# EAGLE design tap sens (EAGLE 9.6.2)
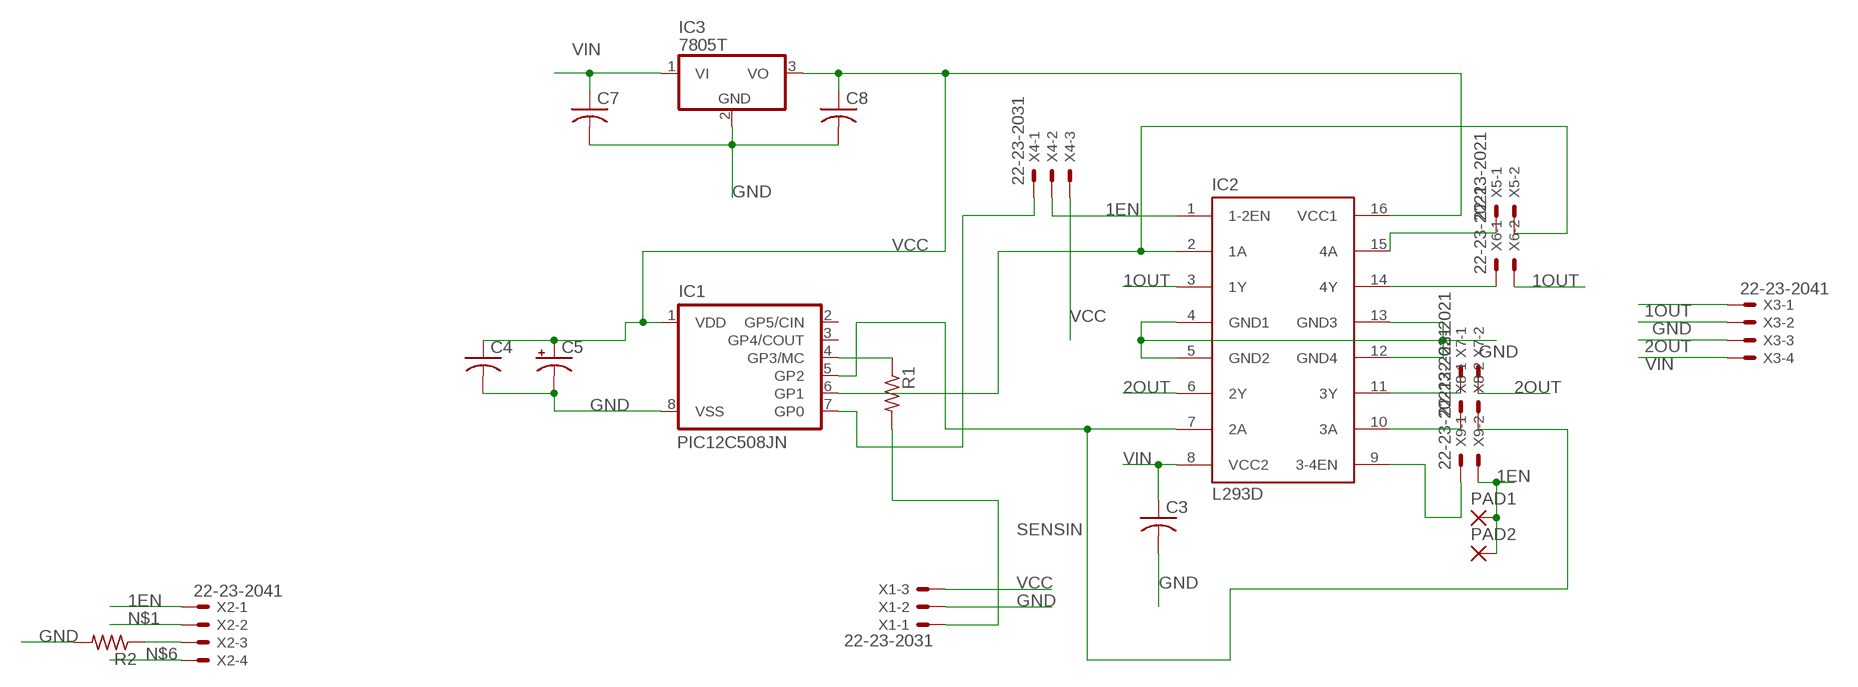
[diagram p0: schematic, sheet 1]

## Parts
C3  C-US050-025X075  [C050-025X075]
C4  C-US050-025X075  [C050-025X075]
C5  CPOL-USE5-8.5  [E5-8,5]
C7  C-US050-025X075  [C050-025X075]
C8  C-US050-025X075  [C050-025X075]
IC1  PIC12C508JN  [DIL8]
IC2  L293D  [DIL16]
IC3  7805T  [TO220H]
PAD1  2,54/0,8  [2,54/0,8]
PAD2  2,54/0,8  [2,54/0,8]
R1  R-US_0207/10  [0207/10]
R2  R-US_0207/10  [0207/10]
X1  22-23-2031  [22-23-2031]
X2  22-23-2041  [22-23-2041]
X3  22-23-2041  [22-23-2041]
X4  22-23-2031  [22-23-2031]
X5  22-23-2021  [22-23-2021]
X6  22-23-2021  [22-23-2021]
X7  22-23-2021  [22-23-2021]
X8  22-23-2021  [22-23-2021]
X9  22-23-2021  [22-23-2021]

## Nets
1EN: IC2.1(1-2EN) PAD1.1(P) PAD2.1(P) X2.1 X4.2 X9.2
1OUT: IC2.3(1Y) X3.1 X6.2
2OUT: IC2.6(2Y) X3.3 X7.2
GND: C3.2 C4.2 C5.- C7.2 C8.2 IC1.8(VSS) IC2.4(GND1) IC2.5(GND2) IC2.12(GND4) IC2.13(GND3) IC3.2(GND) R2.2 X1.2 X3.2
N$1: IC1.6(GP1) IC2.2(1A) X2.2 X5.2
N$2: R2.1 X2.3
N$3: IC1.4(GP3/MC) R1.1
N$6: IC1.5(GP2) IC2.7(2A) X2.4 X8.2
N$9: IC1.7(GP0) X4.1
N$12: IC2.9(3-4EN) X9.1
N$13: IC2.10(3A) X8.1
N$14: IC2.11(3Y) X7.1
N$15: IC2.14(4Y) X6.1
N$16: IC2.15(4A) X5.1
SENSIN: R1.2 X1.1
VCC: C4.1 C5.+ C8.1 IC1.1(VDD) IC2.16(VCC1) IC3.3(VO) X1.3 X4.3
VIN: C3.1 C7.1 IC2.8(VCC2) IC3.1(VI) X3.4
Unconnected: IC1.2(GP5/CIN) IC1.3(GP4/COUT)

## Library data of the parts
C3 C4 C7 C8 = adafruit:C-US: CAPACITOR, American symbol
C5 = adafruit:CPOL-US: POLARIZED CAPACITOR, American symbol
IC1 = microchip:PIC12C*?: MICROCONTROLLER; MF: MICROCHIP; MPN: PIC12C508-04/P; OC_FARNELL: 9758771; OC_NEWARK: 60K6710
IC2 = st-microelectronics:L293D: PUSH-PULL 4 CHANNEL DRIVER; MPN: L293D; OC_FARNELL: 9589619; OC_NEWARK: 56P8249
IC3 = linear:78*: Positive VOLTAGE REGULATOR Source: http://cache.national.com/ds/LM/LM78L05.pdf http://www.fairchildsemi.com/ds/LM/LM7805.pdf
PAD1 PAD2 = wirepad:2,54/0,8: THROUGH-HOLE PAD
R1 R2 = adafruit:R-US_: RESISTOR, American symbol
X1 X4 = con-molex:22-23-2031: .100" (2.54mm) Center Header - 3 Pin; MF: MOLEX; MPN: 22-23-2031; OC_FARNELL: 1462950; OC_NEWARK: 30C0862
X2 X3 = con-molex:22-23-2041: .100" (2.54mm) Center Header - 4 Pin; MF: MOLEX; MPN: 22-23-2041; OC_FARNELL: 1462920; OC_NEWARK: 38C0355
X5-X9 = con-molex:22-23-2021: .100" (2.54mm) Center Header - 2 Pin; MF: MOLEX; MPN: 22-23-2021; OC_FARNELL: 1462926; OC_NEWARK: 25C3832

## Board
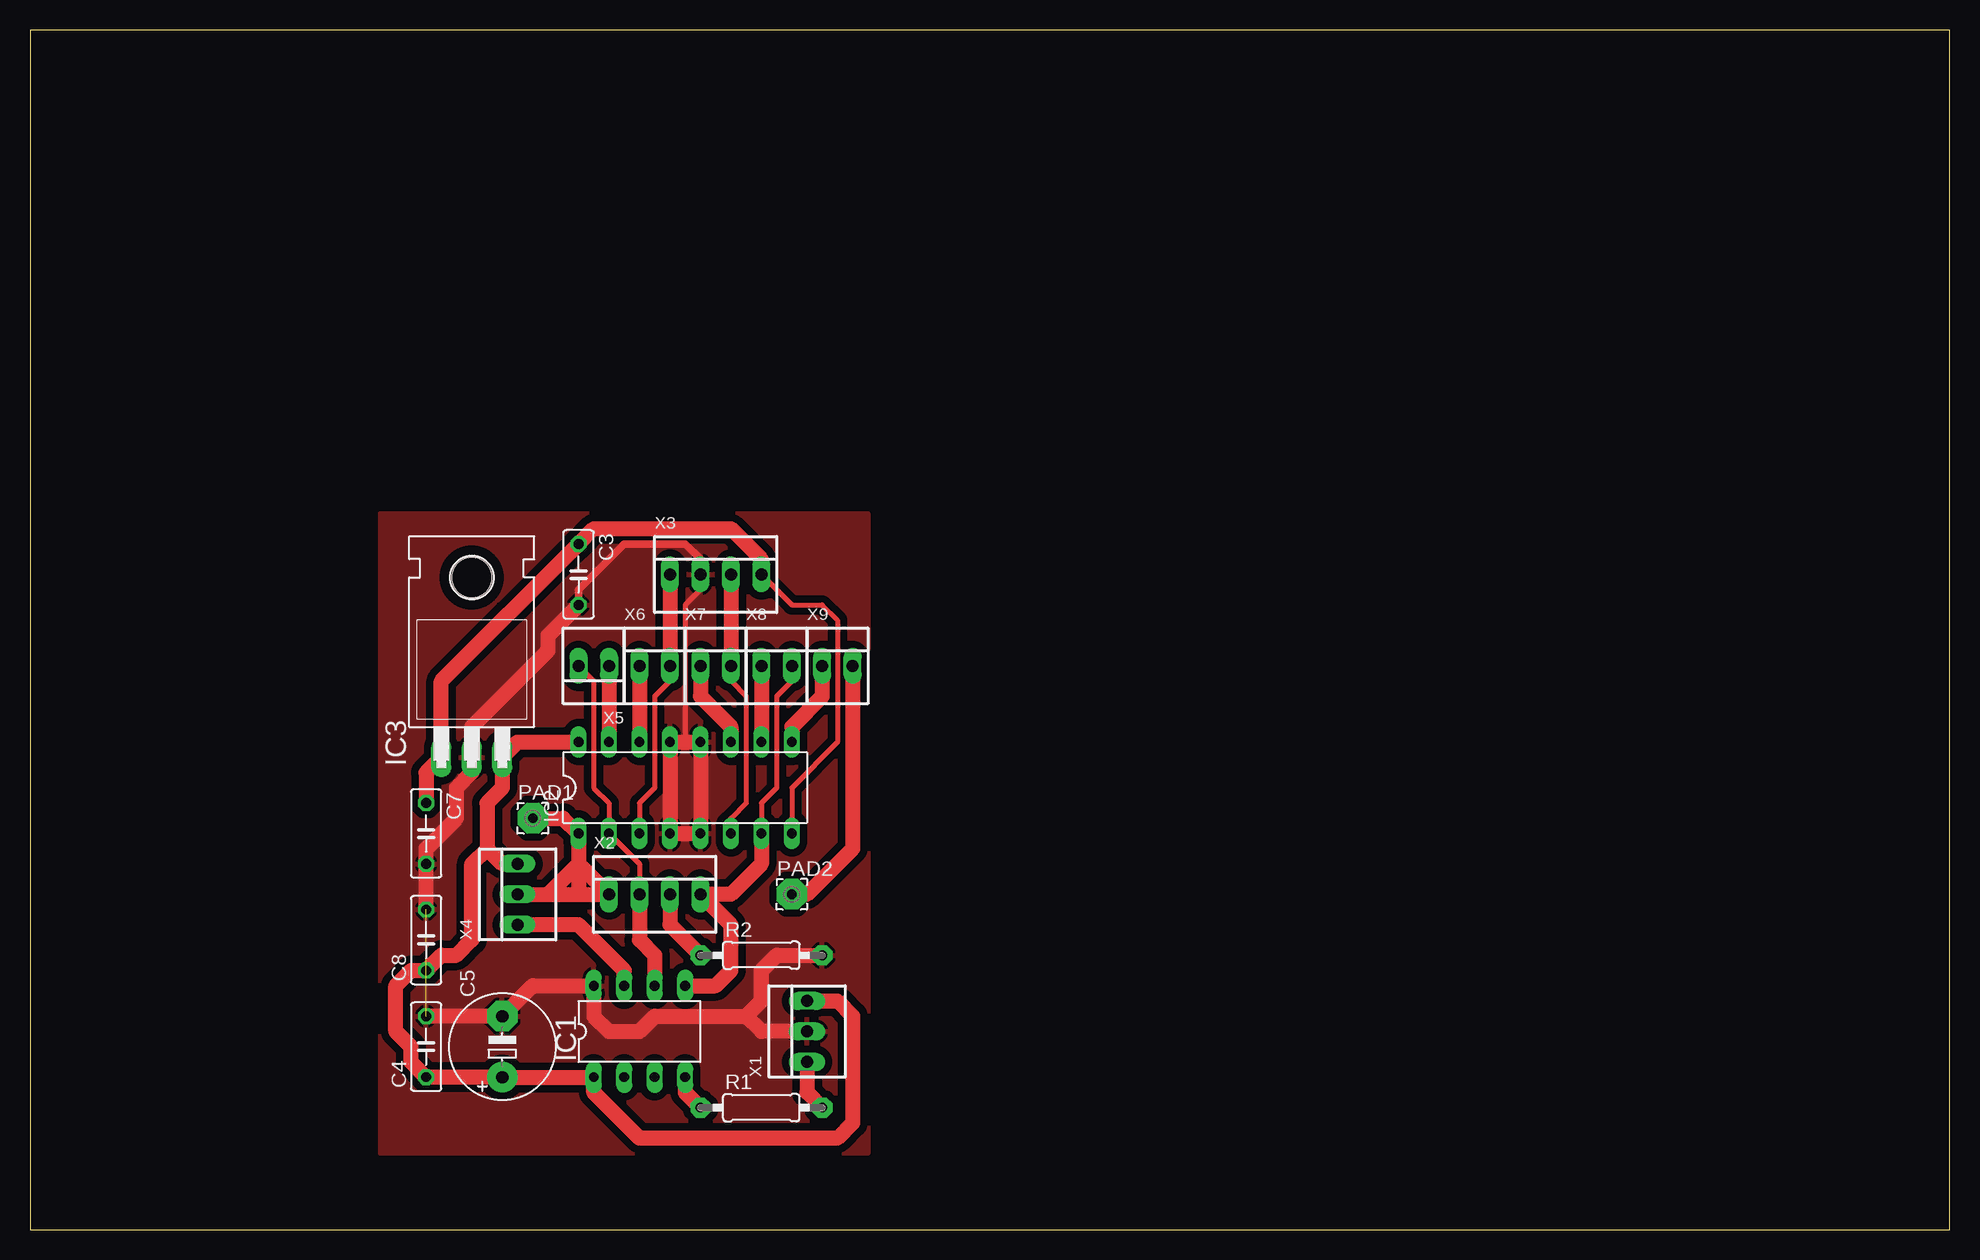
[diagram p1: board, top side]
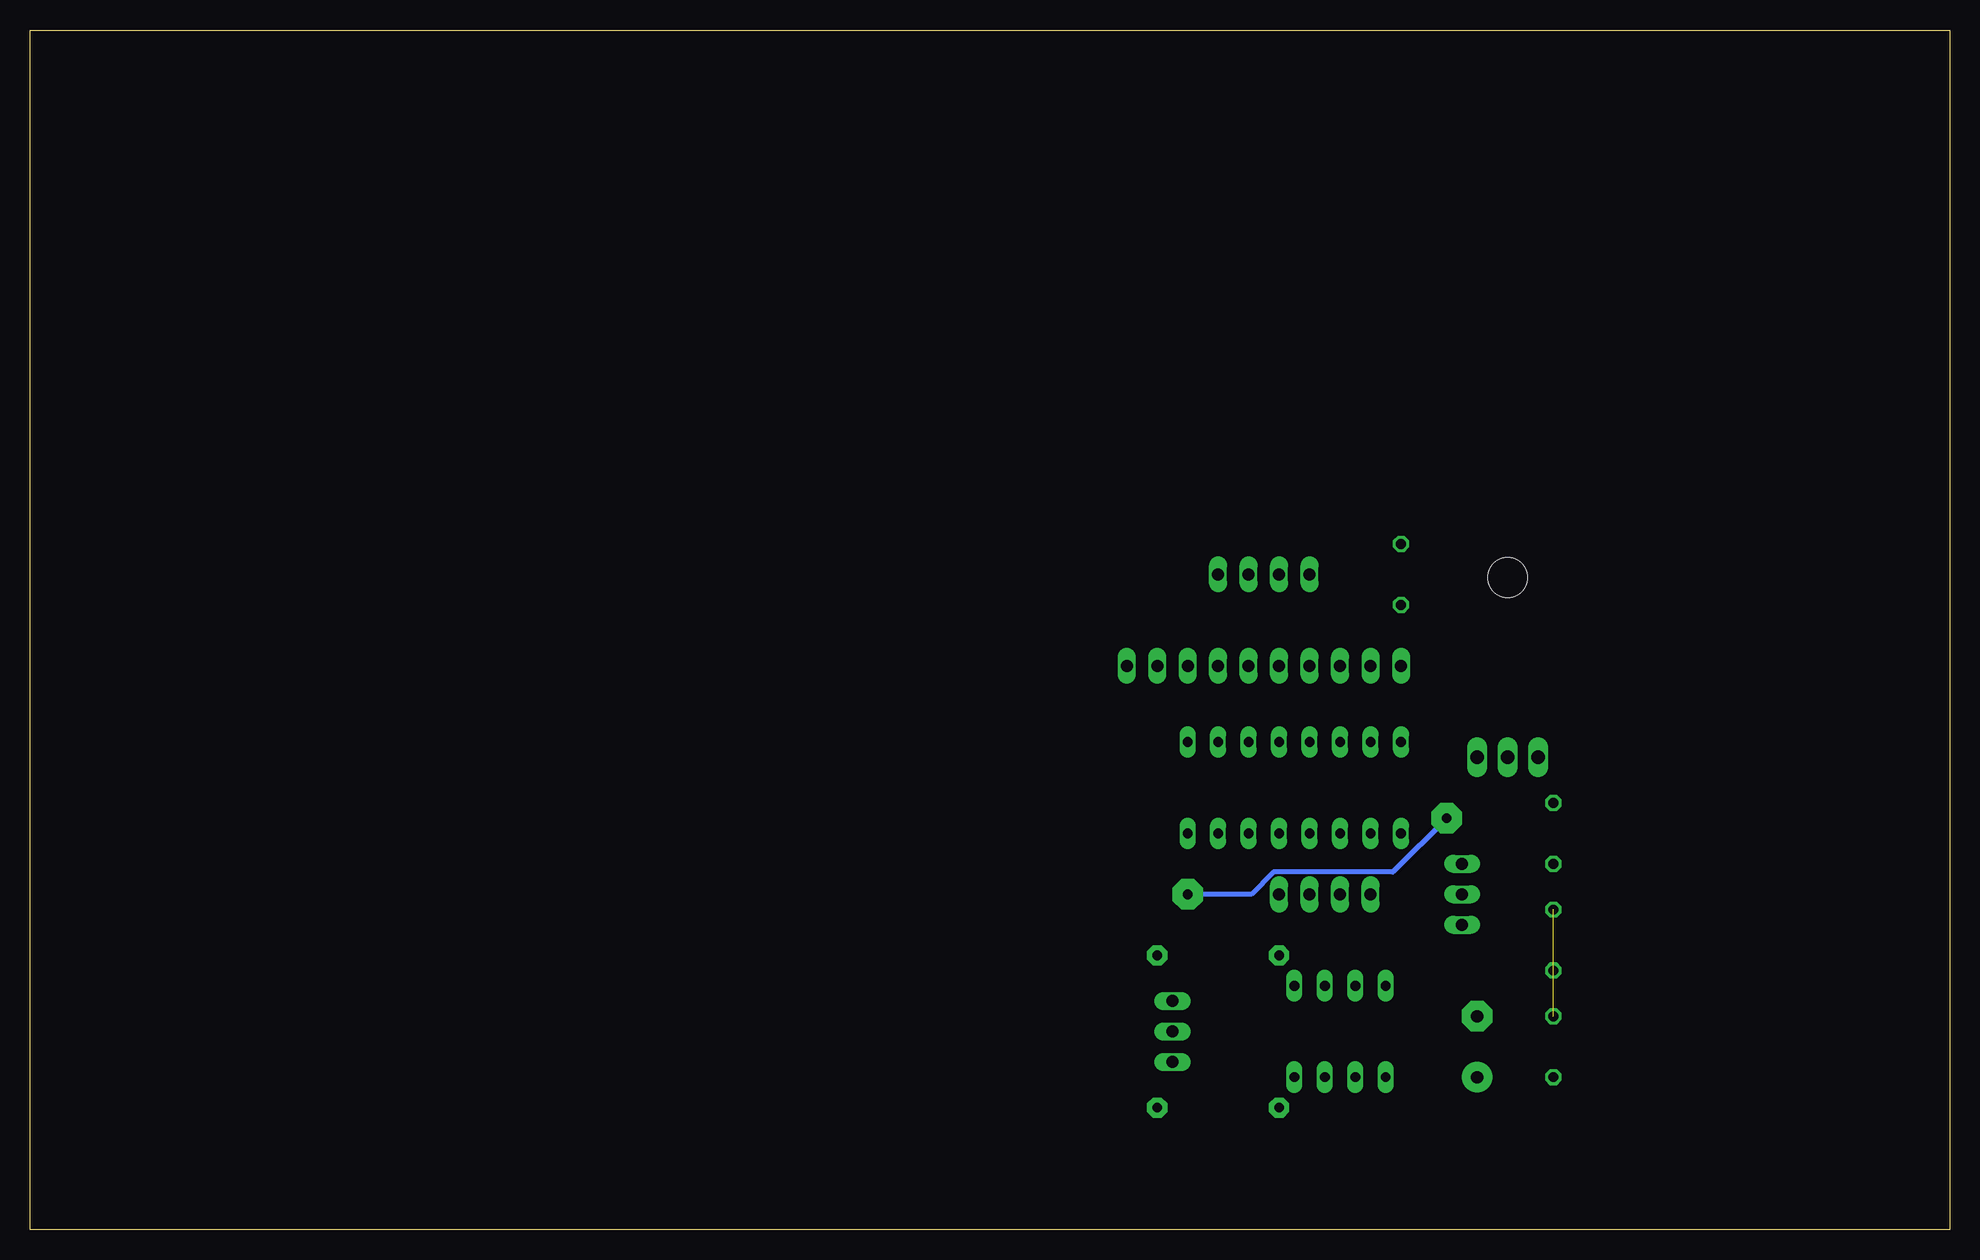
[diagram p2: board, bottom side, seen from below]

Size 160 x 100 mm. Coordinates in mm from the lower left corner, seen from the top.
Outline: 0,0 160,0 160,100 0,100 0,0
Copper layers (1*16): Top 0.035mm / dielectric 1.5mm / Bottom 0.035mm
Design rules "default": minimum track width 6mil, minimum drill 0.35mm, track to track 6mil, track to pad 6mil, pad to pad 6mil, via to via 6mil, smd to smd 6mil, copper to edge 40mil, drill to drill 6mil, minimum pad ring 10mil, minimum via ring 8mil, stop-mask expansion 4mil, vias tented up to drill 0mil, thermal gap 10mil

### Footprints (pad centres in the part's own frame; a part is rotated, then mirrored left to right if it is on the bottom)
C050-025X075 = drill 0.813 octagon: 1 -2.54,0; 2 2.54,0
E5-8,5 = drill 1.016 pad 2.54: + -2.54,0 | drill 1.016 pad 2.54 octagon: - 2.54,0
DIL8 = drill 0.813 long: 1 -3.81,-3.81; 2 -1.27,-3.81; 3 1.27,-3.81; 4 3.81,-3.81; 5 3.81,3.81; 6 1.27,3.81; 7 -1.27,3.81; 8 -3.81,3.81
DIL16 = drill 0.813 long: 1 -8.89,-3.81; 2 -6.35,-3.81; 3 -3.81,-3.81; 4 -1.27,-3.81; 5 1.27,-3.81; 6 3.81,-3.81; 7 6.35,-3.81; 8 8.89,-3.81; 9 8.89,3.81; 10 6.35,3.81; 11 3.81,3.81; 12 1.27,3.81; 13 -1.27,3.81; 14 -3.81,3.81; 15 -6.35,3.81; 16 -8.89,3.81
TO220H = drill 1.118 long: 1 -2.54,-10.16; 2 0,-10.16; 3 2.54,-10.16 | hole 3.302: 0,4.826
2,54/0,8 = drill 0.813 pad 2.54 octagon: 1 0,0
0207/10 = drill 0.813 pad 1.676 octagon: 1 -5.08,0; 2 5.08,0
22-23-2031 = drill 1 long: 1 -2.54,0; 2 0,0; 3 2.54,0
22-23-2041 = drill 1 long: 1 -3.81,0; 2 -1.27,0; 3 1.27,0; 4 3.81,0
22-23-2021 = drill 1 long: 1 -1.27,0; 2 1.27,0

### Placement (x,y rotation side)
C3  45.72,54.61 270 top
C4  33.02,15.24 90 top
C5  39.37,15.24 90 top
C7  33.02,33.02 270 top
C8  33.02,24.13 90 top
IC1  50.8,16.51 0 top
IC2  54.61,36.83 0 top
IC3  36.83,49.53 0 top
PAD1  41.91,34.29 0 top
PAD2  63.5,27.94 0 top
R1  60.96,10.16 0 top
R2  60.96,22.86 0 top
X1  64.77,16.51 90 top
X2  52.07,27.94 0 top
X3  57.15,54.61 0 top
X4  40.64,27.94 90 top
X5  46.99,46.99 180 top
X6  52.07,46.99 0 top
X7  57.15,46.99 0 top
X8  62.23,46.99 0 top
X9  67.31,46.99 0 top

### Tracks (layer width: path | path; a pad name or v marks a point on that pad's centre or on a via)
1EN
  Top 1.27: X4.2 43.18,27.94 | 43.18,27.94 45.72,27.94 | 45.72,27.94 X2.1 45.72,30.48 | PAD1.1 44.45,34.29 IC2.1 45.72,30.48 | 45.72,30.48 45.72,27.94 | 45.72,30.48 43.18,27.94 | X9.2 68.58,31.75 64.77,27.94 PAD2.1
  Bottom 0.406: PAD2.1 58.2,27.94 56.34,29.8 46.4,29.8 PAD1.1
1OUT
  Top 0.406: X6.2 53.34,45.72 52.07,44.45 52.07,36.83 50.8,35.56 IC2.3
  Top 1.27: X3.1 X6.2
2OUT
  Top 0.406: X7.2 58.42,45.72 59.69,44.45 59.69,35.56 58.42,34.29 IC2.6
  Top 1.27: X3.3 X7.2
GND  (1 unrouted)
  Top 0.406: X3.2 55.88,53.34 54.61,52.07 54.61,40.64
  Top 0.61: C3.2 45.72,53.34 49.53,57.15 54.61,57.15 55.88,55.88 X3.2
  Top 1.27: 59.69,17.78 52.07,17.78 50.8,16.51 48.26,16.51 46.99,17.78 IC1.8 41.91,20.32 C5.- | 59.69,17.78 60.96,19.05 60.96,21.59 62.23,22.86 R2.2 | X1.2 60.96,16.51 59.69,17.78 | C8.2 C7.2 33.02,31.75 35.56,34.29 35.56,36.83 36.83,38.1 IC3.2 36.83,41.91 43.18,48.26 43.18,49.53 C3.2 | C5.- 40.01,18.41 | C5.- C4.2 | IC2.13 IC2.4 IC2.5 IC2.12 54.61,40.64 IC2.13
  pour Top (isolate 0.61): 31.75,59.69 69.85,59.69 69.85,6.35 29.21,6.35 29.21,59.69
N$1
  Top 0.406: X5.2 46.99,45.72 46.99,36.83 48.26,35.56 IC2.2 50.8,30.48 X2.2
  Top 1.27: X2.2 50.8,24.13 52.07,22.86 IC1.6
N$2
  Top 1.27: X2.3 53.34,25.4 R2.1
N$3
  Top 1.27: IC1.4 54.61,11.43 R1.1
N$6
  Top 0.406: X8.2 63.5,45.72 62.23,44.45 62.23,36.83 60.96,35.56 IC2.7
  Top 1.27: IC1.5 57.15,20.32 58.42,21.59 58.42,25.4 X2.4 58.42,27.94 60.96,30.48 IC2.7
N$9
  Top 1.27: IC1.7 49.53,21.59 45.72,25.4 X4.1
N$12
  Top 1.27: X9.1 66.04,44.45 63.5,41.91 IC2.9
N$13
  Top 1.27: X8.1 IC2.10
N$14
  Top 1.27: IC2.11 58.42,41.91 55.88,44.45 X7.1
N$15
  Top 1.27: X6.1 IC2.14
N$16
  Top 1.27: X5.1 IC2.15
SENSIN
  Top 1.27: X1.1 64.77,11.43 R1.2
VCC
  Top 1.27: X1.3 67.31,19.05 68.58,17.78 68.58,8.89 67.31,7.62 50.8,7.62 46.99,11.43 IC1.1 C5.+ C4.1 31.75,13.97 31.75,15.24 30.48,16.51 30.48,20.32 31.75,21.59 C8.1 34.29,22.86 35.56,22.86 36.83,24.13 36.83,30.48 38.1,31.75 | IC2.16 40.64,40.64 IC3.3 39.37,36.83 38.1,35.56 38.1,31.75 | 38.1,31.75 39.37,30.48 X4.3
VIN
  Top 0.406: 63.5,34.29 IC2.8 63.5,36.83 67.31,40.64 67.31,50.8 66.04,52.07 63.5,52.07 X3.4 | IC3.1 34.29,38.1
  Top 1.27: C7.1 33.02,38.1 IC3.1 34.29,45.72 C3.1 46.99,58.42 58.42,58.42 60.96,55.88 X3.4
  Bottom 0.406: 60.74,54.61 X3.4